# Altium schematic sheet RS485.SchDoc
size A
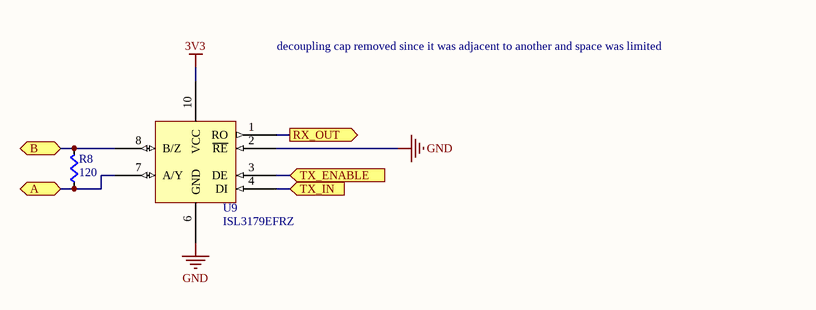
[diagram p0: RS485.SchDoc]

## Parts
R8  value 120  [RES0603]  (hidden comment: Res)
U9  ISL3179EFRZ  [ISL3179EFRZ_NO_VIAS]

## Ports
A (bidir), B (bidir), RX_OUT (out), TX_ENABLE (in), TX_IN (in)

## Nets
3V3: U9.10(VCC)
GND: U9.2(~{RE}) U9.6(GND)
A: R8.2(B) U9.7(A/Y) ; port A
B: R8.1(A) U9.8(B/Z) ; port B
RX_OUT: U9.1(RO) ; port RX_OUT
TX_ENABLE: U9.3(DE) ; port TX_ENABLE
TX_IN: U9.4(DI) ; port TX_IN

## Notes on the sheet
- decoupling cap removed since it was adjacent to another and space was limited

## Library data of the parts
U9 = ISL3179EFRZ: TXRX ESD 3.3V RS-485/422 10-DFN; Supplier 1: Digi-Key; Supplier Part Number 1: ISL3179EFRZ-ND
R8 = Res: Supplier 1: Digi-Key; Supplier Part Number 1: 311-120HRCT-ND